# Altium schematic sheet Thermistor.SchDoc
size A4
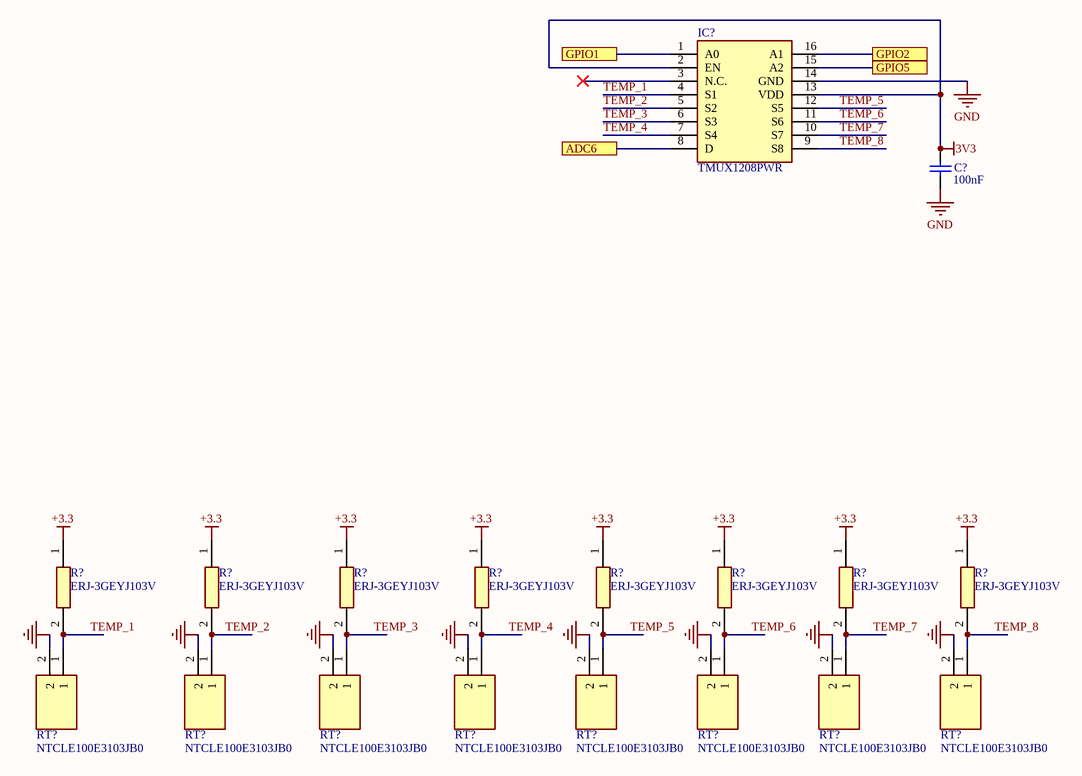
[diagram p0: Thermistor.SchDoc]

## Parts
(Parts that share a designator on the sheet are numbered #1, #2 ... from top to bottom, then left to right.)
C?  value 100nF  [C0805]  (hidden comment: 10V)
IC?  TMUX1208PWR  [SOP65P640X120-16N]
R?#1  ERJ-3GEYJ103V  [RESC1608X55N]
R?#2  ERJ-3GEYJ103V  [RESC1608X55N]
R?#3  ERJ-3GEYJ103V  [RESC1608X55N]
R?#4  ERJ-3GEYJ103V  [RESC1608X55N]
R?#5  ERJ-3GEYJ103V  [RESC1608X55N]
R?#6  ERJ-3GEYJ103V  [RESC1608X55N]
R?#7  ERJ-3GEYJ103V  [RESC1608X55N]
R?#8  ERJ-3GEYJ103V  [RESC1608X55N]
RT?#1  NTCLE100E3103JB0  [NTCLE100E3103JB0]
RT?#2  NTCLE100E3103JB0  [NTCLE100E3103JB0]
RT?#3  NTCLE100E3103JB0  [NTCLE100E3103JB0]
RT?#4  NTCLE100E3103JB0  [NTCLE100E3103JB0]
RT?#5  NTCLE100E3103JB0  [NTCLE100E3103JB0]
RT?#6  NTCLE100E3103JB0  [NTCLE100E3103JB0]
RT?#7  NTCLE100E3103JB0  [NTCLE100E3103JB0]
RT?#8  NTCLE100E3103JB0  [NTCLE100E3103JB0]

## Ports
ADC6, GPIO1, GPIO2, GPIO5

## Nets
3V3: C?.1 IC?.2(EN) IC?.13(VDD)
+3.3: R?#1.1 R?#2.1 R?#3.1 R?#4.1 R?#5.1 R?#6.1 R?#7.1 R?#8.1
GND: C?.2 IC?.14(GND)
NetRT?#1_2: RT?#1.2 RT?#2.2 RT?#3.2 RT?#4.2 RT?#5.2 RT?#6.2 RT?#7.2 RT?#8.2
ADC6: IC?.8(D) ; port ADC6
GPIO1: IC?.1(A0) ; port GPIO1
GPIO2: IC?.16(A1) ; port GPIO2
GPIO5: IC?.15(A2) ; port GPIO5
TEMP_1: IC?.4(S1) R?#1.2 RT?#1.1
TEMP_2: IC?.5(S2) R?#2.2 RT?#2.1
TEMP_3: IC?.6(S3) R?#3.2 RT?#3.1
TEMP_4: IC?.7(S4) R?#4.2 RT?#4.1
TEMP_5: IC?.12(S5) R?#5.2 RT?#5.1
TEMP_6: IC?.11(S6) R?#6.2 RT?#6.1
TEMP_7: IC?.10(S7) R?#7.2 RT?#7.1
TEMP_8: IC?.9(S8) R?#8.2 RT?#8.1

Not connected (* = marked no-connect by the designer): IC? 3(N.C.)*

## Library data of the parts
C? = Cap: C0805C104K8RACTU. 0.1µF ±10% 10V Ceramic Capacitor X7R 0805 (2012 Metric) /; Published: 8-Jun-2000; LatestRevisionDate: 17-Jul-2002; LatestRevisionNote: Re-released for DXP Platform.; PackageReference: RAD-0.3; Publisher: Altium Limited; PackageDescription: Radial Cap, Thru-Hole; 2 Leads; 0.3 in Pin Spacing
IC? = TMUX1208PWR: Integrated Circuit; Manufacturer_Name: Texas Instruments; Datasheet Link: http://www.ti.com/lit/gpn/tmux1208; Height: 1.2mm; Manufacturer_Part_Number: TMUX1208PWR; Mouser Part Number: 595-TMUX1208PWR; Mouser Price/Stock: https://www.mouser.co.uk/ProductDetail/Texas-Instruments/TMUX1208PWR/?qs=lc2O%252BfHJPVbYdIGs2%2FdugA%3D%3D; Arrow Part Number: TMUX1208PWR; Arrow Price/Stock: https://www.arrow.com/en/products/tmux1208pwr/texas-instruments
R?#1-R?#8 = ERJ-3GEYJ103V: Resistor; Manufacturer_Name: Panasonic; Datasheet Link: http://docs-emea.rs-online.com/webdocs/13ba/0900766b813ba21b.pdf; Height: 0.55mm; Manufacturer_Part_Number: ERJ-3GEYJ103V; Mouser Part Number: 667-ERJ-3GEYJ103V; Mouser Price/Stock: https://www.mouser.co.uk/ProductDetail/Panasonic/ERJ-3GEYJ103V/?qs=66DK8nO8gJBWgc%252B0VNNxzg%3D%3D; Arrow Part Number: ERJ-3GEYJ103V; Arrow Price/Stock: https://www.arrow.com/en/products/erj-3geyj103v/panasonic
RT?#1-RT?#8 = NTCLE100E3103JB0: Thermistor; Manufacturer_Name: Vishay; Datasheet Link: https://www.mouser.com/datasheet/2/427/ntcle100-222385.pdf; Height: 10mm; Manufacturer_Part_Number: NTCLE100E3103JB0; Mouser Part Number: 594-2381-640-63103; Mouser Price/Stock: https://www.mouser.co.uk/ProductDetail/Vishay-BC-Components/NTCLE100E3103JB0/?qs=MSh2oj3GFQcs%2FteGkdbngw%3D%3D; Arrow Part Number: NTCLE100E3103JB0; Arrow Price/Stock: https://www.arrow.com/en/products/ntcle100e3103jb0/vishay